# EAGLE schematic relay (EAGLE 7.7.0)
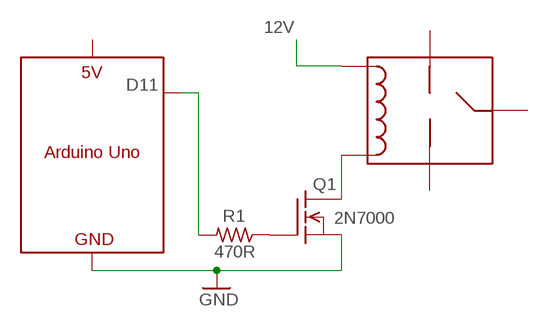
[diagram p0: schematic, sheet 1]

## Parts
K2  RELAY-HLS8L-DC3V-S-C(5P-19X15MM)  [REY5-19.0X15.0X15.0MM]
Q1  2N7000  BSS101  [TO92]
R1  470R  R-US_M1206  [M1206]
U$1  ARDUINO_1_PIN  [ARDUINO_1_PIN]

## Nets
GND: Q1.3(S) U$1.GND
N$1: K2.2(V+)
N$2: Q1.2(G) R1.1
N$3: K2.3(V-) Q1.1(D)
N$4: R1.2 U$1.PIN1
Unconnected: K2.1(COM) K2.4(NO) K2.5(NC) U$1.5V

## Notes on the sheet
- 12V
- D11

## Library data of the parts
K2 = BOOK:RELAY-HLS8L-DC3V-S-C(5P-19X15MM): 315030009; MPN: HLS8L-DC3V-S-C; VALUE: HLS8L-DC3V-S-C
Q1 = BOOK:BSS101: N-Channel Enhancement MOSFET 200V; 0,16A; 11Ohm
R1 = BOOK:R-US_: RESISTOR, American symbol
U$1 = BOOK:ARDUINO_1_PIN